# Altium schematic sheet 03_Power_Switch.SchDoc
size A4
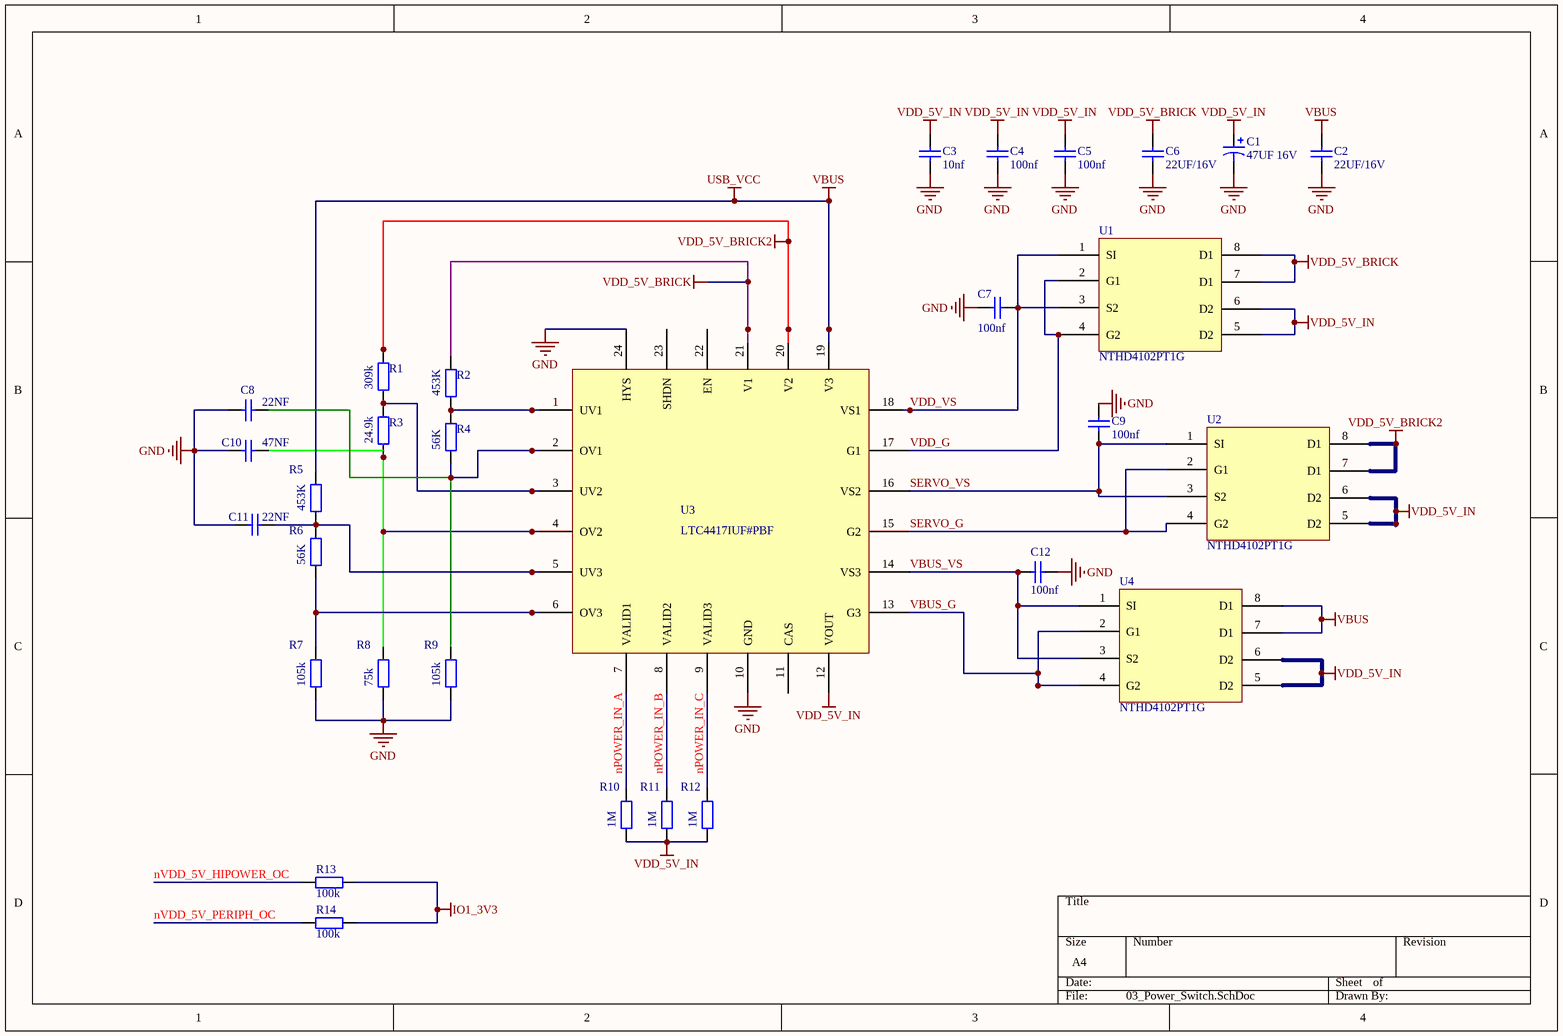
[diagram p0: 03_Power_Switch.SchDoc]

## Parts
C1  47UF 16V  [7343CAP]
C2  22UF/16V  [0805CAP]
C3  10nf  [0402CAP]
C4  100nf  [0402CAP]
C5  100nf  [0402CAP]
C6  22UF/16V  [0805CAP]
C7  100nf  [0402CAP]
C8  22NF  [0402CAP]
C9  100nf  [0402CAP]
C10  47NF  [0402CAP]
C11  22NF  [0402CAP]
C12  100nf  [0402CAP]
R1  309k  [R0402]
R2  453K  [R0402]
R3  24.9k  [R0402]
R4  56K  [R0402]
R5  453K  [R0402]
R6  56K  [R0402]
R7  105k  [R0402]
R8  75k  [R0402]
R9  105k  [R0402]
R10  1M  [R0402]
R11  1M  [R0402]
R12  1M  [R0402]
R13  100k  [R0402]
R14  100k  [R0402]
U1  NTHD4102PT1G  [1206-8]
U2  NTHD4102PT1G  [1206-8]
U3  LTC4417IUF#PBF  [QFN24]
U4  NTHD4102PT1G  [1206-8]

## Nets
GND: C1.C C2.1 C3.1 C4.1 C5.1 C6.1 C7.2 C8.2 C9.2 C10.2 C11.2 C12.2 R7.1 R8.1 R9.1 U3.10(GND) U3.24(HYS)
IO1_3V3: R13.2 R14.2
USB_VCC: C2.2 R5.2 U3.19(V3) U4.7(D1) U4.8(D1)  [also labelled VBUS]
VDD_5V_BRICK: C6.2 R2.2 U1.7(D1) U1.8(D1) U3.21(V1)
VDD_5V_BRICK2: R1.2 U2.7(D1) U2.8(D1) U3.20(V2)
VDD_5V_IN: C1.A C3.2 C4.2 C5.2 R10.1 R11.1 R12.1 U1.5(D2) U1.6(D2) U2.5(D2) U2.6(D2) U3.12(VOUT) U4.5(D2) U4.6(D2)
nPOWER_IN_A: R10.2 U3.7(VALID1)
nPOWER_IN_B: R11.2 U3.8(VALID2)
nPOWER_IN_C: R12.2 U3.9(VALID3)
nVDD_5V_HIPOWER_OC: R13.1
nVDD_5V_PERIPH_OC: R14.1
SERVO_G: U2.2(G1) U2.4(G2) U3.15(G2)
SERVO_VS: C9.1 U2.1(SI) U2.3(S2) U3.16(VS2)
VBUS_G: U3.13(G3) U4.2(G1) U4.4(G2)
VBUS_VS: C12.1 U3.14(VS3) U4.1(SI) U4.3(S2)
VDD_G: U1.2(G1) U1.4(G2) U3.17(G1)
VDD_VS: C7.1 U1.1(SI) U1.3(S2) U3.18(VS1)
NetC8_1: C8.1 R4.1 R9.2 U3.2(OV1)
NetC10_1: C10.1 R3.1 R8.2 U3.4(OV2)
NetC11_1: C11.1 R5.1 R6.2 U3.5(UV3)
NetR1_1: R1.1 R3.2 U3.3(UV2)
NetR2_1: R2.1 R4.2 U3.1(UV1)
NetR6_1: R6.1 R7.2 U3.6(OV3)

Not connected (* = marked no-connect by the designer): U3 11(CAS) 22(EN) 23(SHDN)

## Library data of the parts
C1 = Cap Pol1: Polarized Capacitor (Radial); Value: 100pF; Published: 8-Jun-2000; LatestRevisionDate: 17-Jul-2002; LatestRevisionNote: Re-released for DXP Platform.; PackageReference: RB7.6-15; Publisher: Altium Limited; PackageDescription: Polarized Capacitor (Radial); 2 Leads
C2-C12 = Cap: Value: 100pF; Published: 8-Jun-2000; LatestRevisionDate: 17-Jul-2002; LatestRevisionNote: Re-released for DXP Platform.; PackageReference: RAD-0.3; Publisher: Altium Limited; PackageDescription: Radial Cap, Thru-Hole; 2 Leads; 0.3 in Pin Spacing
R1-R14 = Res2: Resistor; Value: 1K; Published: 8-Jun-2000; LatestRevisionDate: 17-Jul-2002; LatestRevisionNote: Re-released for DXP Platform.; PackageReference: AXIAL-0.4; Publisher: Altium Limited; PackageDescription: Axial Device, Thru-Hole; 2 Leads; 0.4 in Pin Spacing